# EAGLE design 705_breakout_3pin_2mm (EAGLE 9.6.2)
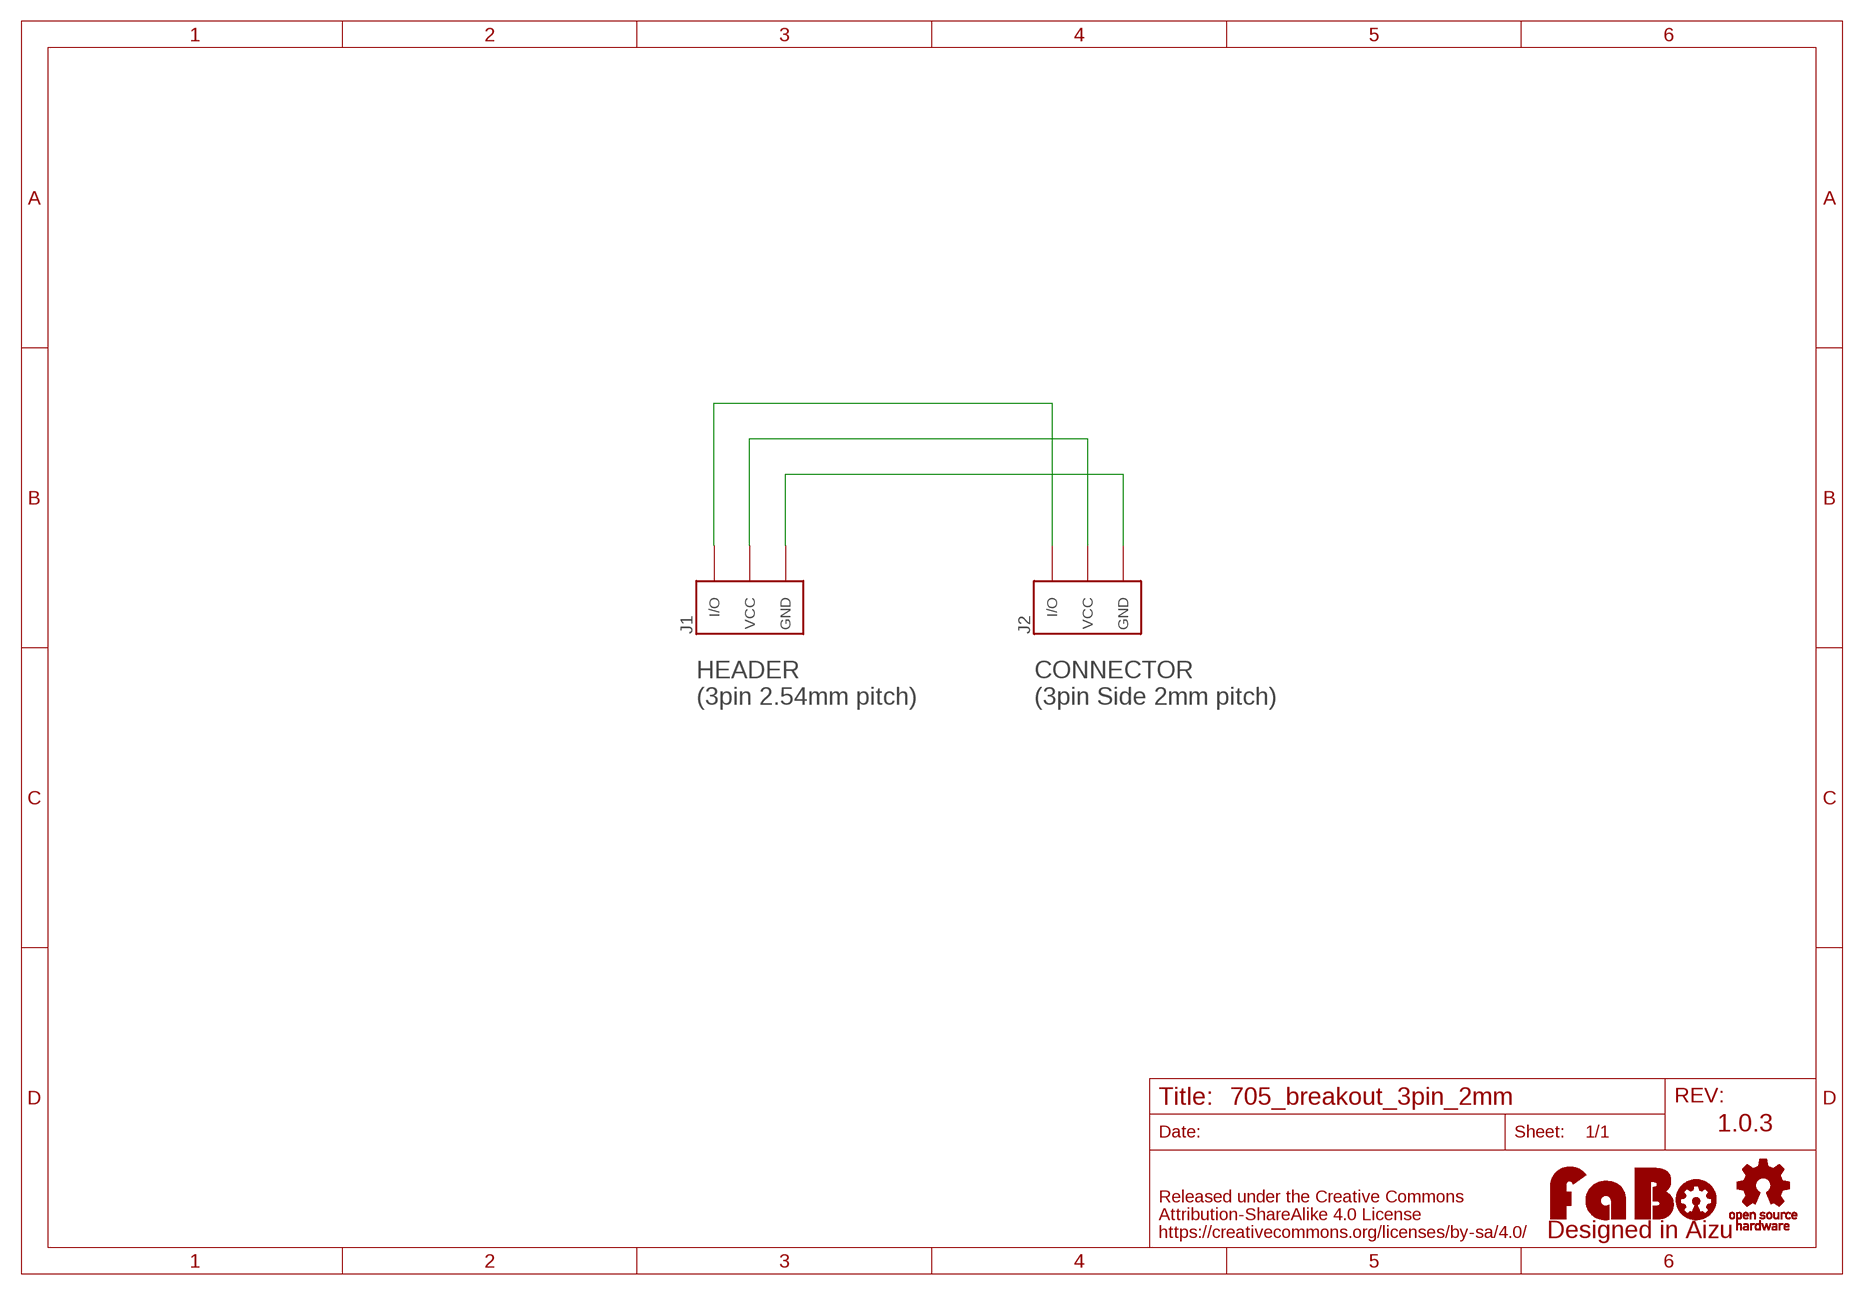
[diagram p0: schematic, sheet 1]

## Parts
J1  FABO_BRICK_3PIN-BREAKOUT  [FABO_BRICK_3PIN_BREAKOUT]
J2  FABO_BRICK_3PIN-S03B-PASK-2  [FABO_BRICK_3PIN_S03B-PASK-2]
U$2  LOGO_FABO-M_BOTTOM  [LOGO_FABO_MS_BOTTOM]
U$3  LOGO_OSHW-S_BOTTOM  [LOGO_OSHW_S_BOTTOM]

## Nets
GND: J1.GND J2.GND
IO: J1.I/O J2.I/O
VCC: J1.VCC J2.VCC

## Notes on the sheet
- HEADER
  (3pin 2.54mm pitch)
- CONNECTOR
  (3pin Side 2mm pitch)
- 1.0.3

## Library data of the parts
J1 J2 = FaBo-Template:FABO_BRICK_3PIN: FaBo Brick 3pin
U$2 = FaBo-Logo:LOGO_FABO
U$3 = FaBo-etc:LOGO_OSHW

## Board
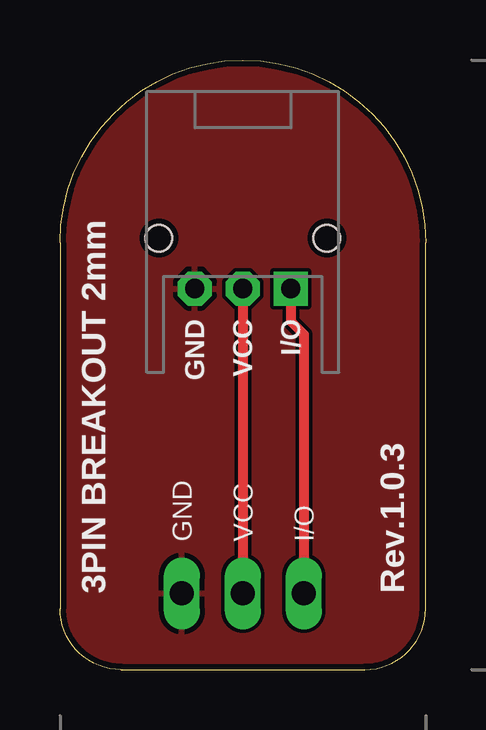
[diagram p1: board, top side]
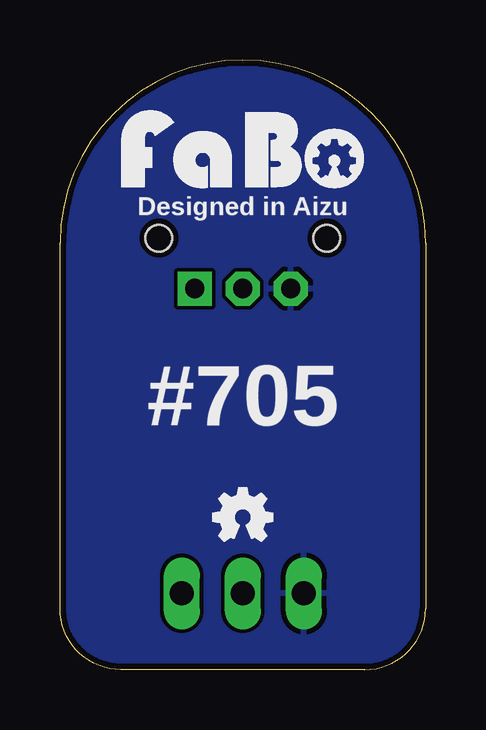
[diagram p2: board, bottom side, seen from below]

Size 15.24 x 25.4 mm. Coordinates in mm from the lower left corner, seen from the top.
Copper layers (1*16): Top 0.035mm / dielectric 1.6mm / Bottom 0.035mm
Design rules "PCBway": minimum track width 6mil, minimum drill 12mil, track to track 6mil, track to pad 6mil, pad to pad 6mil, via to via 6mil, smd to smd 6mil, copper to edge 10mil, drill to drill 10mil, minimum pad ring 10mil, minimum via ring 6mil, stop-mask expansion 2mil, vias tented up to drill 100mil, thermal gap 8mil

### Footprints (pad centres in the part's own frame; a part is rotated, then mirrored left to right if it is on the bottom)
FABO_BRICK_3PIN_BREAKOUT = drill 1 long: GND -2.54,-10.795; I/O 2.54,-10.795; VCC 0,-10.795
FABO_BRICK_3PIN_S03B-PASK-2 = drill 0.8 pad 1.422 octagon: GND -2,0; VCC 0,0 | drill 0.8 pad 1.422 square: I/O 2,0 | hole 1.1: 3.5,2.1; -3.5,2.1

### Placement (x,y rotation side)
J1  7.62,13.97 0 top
J2  7.62,15.88 0 top
U$2  7.62,19.68 0 top
U$3  7.62,6.35 0 top

### Tracks (layer width: path | path; a pad name or v marks a point on that pad's centre or on a via)
GND
  pour Bottom: -1.27,-1.27 16.51,-1.27 16.51,26.67 -1.27,26.67
  pour Top: -1.27,-1.27 16.51,-1.27 16.51,26.67 -1.27,26.67
IO
  Top 0.406: J2.I/O 9.62,14.51 10.16,13.97 J1.I/O
VCC
  Top 0.406: J2.VCC J1.VCC

### Text on the board
tPlace: GND | VCC | I/O | 3PIN BREAKOUT 2mm | Rev.1.0.3
bPlace: Designed in Aizu | #705